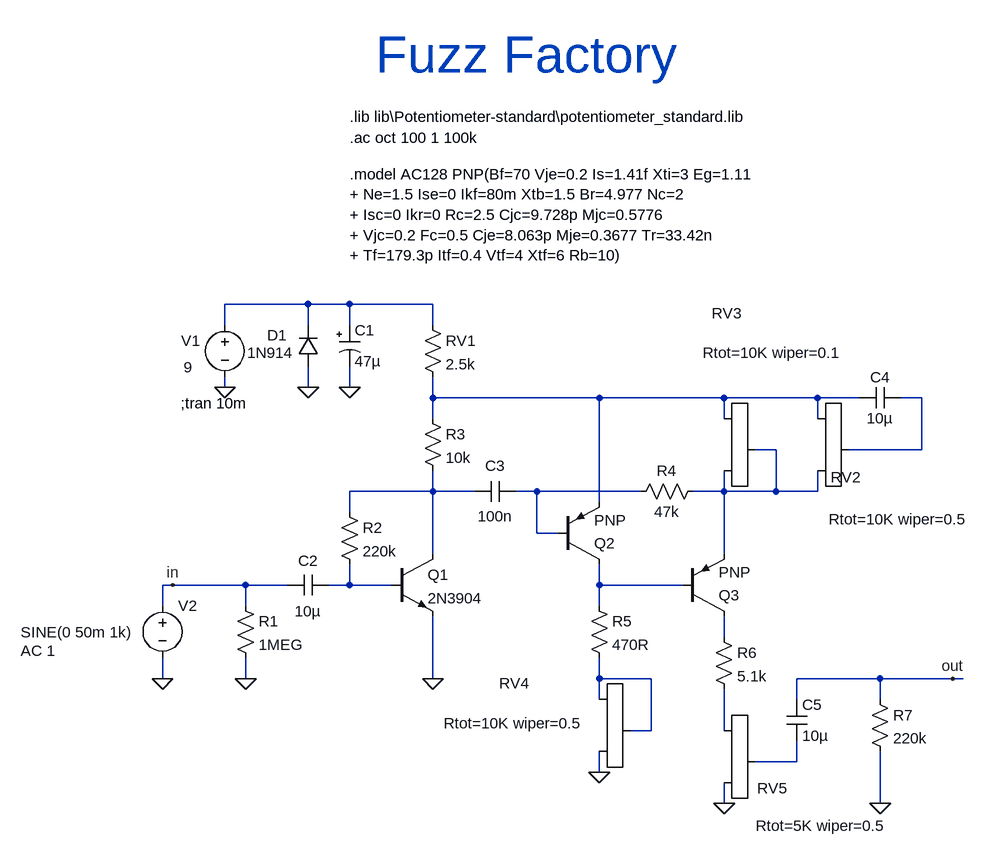
[diagram p0: schematic Fuzz Factory.asc]
Fuzz Factory.asc, the LTspice schematic file:
Version 4
SHEET 1 1632 832
WIRE 240 -16 112 -16
WIRE 304 -16 240 -16
WIRE 432 -16 304 -16
WIRE 112 16 112 -16
WIRE 240 16 240 -16
WIRE 304 16 304 -16
WIRE 432 16 432 -16
WIRE 112 112 112 96
WIRE 240 112 240 80
WIRE 304 112 304 80
WIRE 432 128 432 96
WIRE 688 128 432 128
WIRE 880 128 688 128
WIRE 1024 128 880 128
WIRE 1088 128 1024 128
WIRE 1184 128 1152 128
WIRE 432 160 432 128
WIRE 880 160 880 128
WIRE 1024 160 1024 128
WIRE 960 208 928 208
WIRE 1184 208 1184 128
WIRE 1184 208 1072 208
WIRE 432 272 432 240
WIRE 432 272 304 272
WIRE 496 272 432 272
WIRE 592 272 560 272
WIRE 752 272 592 272
WIRE 880 272 880 240
WIRE 880 272 832 272
WIRE 960 272 960 208
WIRE 960 272 880 272
WIRE 1024 272 1024 240
WIRE 1024 272 960 272
WIRE 688 288 688 128
WIRE 304 304 304 272
WIRE 592 336 592 272
WIRE 624 336 592 336
WIRE 432 368 432 272
WIRE 880 368 880 272
WIRE 32 416 16 416
WIRE 144 416 32 416
WIRE 208 416 144 416
WIRE 304 416 304 384
WIRE 304 416 272 416
WIRE 368 416 304 416
WIRE 688 416 688 384
WIRE 816 416 688 416
WIRE 16 448 16 416
WIRE 144 448 144 416
WIRE 688 448 688 416
WIRE 880 496 880 464
WIRE 16 560 16 528
WIRE 144 560 144 528
WIRE 432 560 432 464
WIRE 688 560 688 528
WIRE 768 560 688 560
WIRE 1120 560 992 560
WIRE 1232 560 1120 560
WIRE 1248 560 1232 560
WIRE 688 592 688 560
WIRE 992 592 992 560
WIRE 1120 592 1120 560
WIRE 768 640 768 560
WIRE 768 640 736 640
WIRE 880 640 880 576
WIRE 992 688 992 656
WIRE 992 688 928 688
WIRE 688 704 688 672
WIRE 880 752 880 720
WIRE 1120 752 1120 672
FLAG 240 112 0
FLAG 304 112 0
FLAG 112 112 0
FLAG 144 560 0
FLAG 432 560 0
FLAG 16 560 0
FLAG 688 704 0
FLAG 880 752 0
FLAG 1120 752 0
FLAG 1232 560 out
FLAG 32 416 in
SYMBOL diode 256 80 R180
WINDOW 0 48 48 Left 2
WINDOW 3 38 21 Left 2
SYMATTR InstName D1
SYMATTR Value 1N914
SYMBOL polcap 288 16 R0
WINDOW 3 24 56 Left 2
SYMATTR InstName C1
SYMATTR Value 47µ
SYMATTR Description Capacitor
SYMATTR Type cap
SYMATTR SpiceLine V=25 Irms=90m Rser=1.6 Lser=0 mfg="Nichicon" pn="UPR1E470MAH" type="Al electrolytic"
SYMBOL voltage 112 0 R0
WINDOW 0 -67 40 Left 2
WINDOW 3 -63 81 Left 2
WINDOW 123 0 0 Left 2
WINDOW 39 0 0 Left 2
SYMATTR InstName V1
SYMATTR Value 9
SYMBOL npn 368 368 R0
SYMATTR InstName Q1
SYMATTR Value 2N3904
SYMBOL res 416 144 R0
SYMATTR InstName R3
SYMATTR Value 10k
SYMBOL res 288 288 R0
SYMATTR InstName R2
SYMATTR Value 220k
SYMBOL cap 272 400 R90
WINDOW 0 -6 32 VBottom 2
WINDOW 3 41 32 VTop 2
SYMATTR InstName C2
SYMATTR Value 10µ
SYMBOL res 128 432 R0
SYMATTR InstName R1
SYMATTR Value 1MEG
SYMBOL voltage 16 432 R0
WINDOW 3 -218 57 Left 2
WINDOW 123 -218 85 Left 2
WINDOW 39 0 0 Left 2
SYMATTR InstName V2
SYMATTR Value SINE(0 50m 1k)
SYMATTR Value2 AC 1
SYMBOL cap 560 256 R90
WINDOW 0 -8 32 VBottom 2
WINDOW 3 39 32 VTop 2
SYMATTR InstName C3
SYMATTR Value 100n
SYMBOL pnp 624 384 M180
SYMATTR InstName Q2
SYMBOL pnp 816 464 M180
SYMATTR InstName Q3
SYMBOL res 672 432 R0
SYMATTR InstName R5
SYMATTR Value 470R
SYMBOL potentiometer_standard 672 576 R0
WINDOW 0 -138 -9 Left 2
WINDOW 3 -223 53 Left 2
WINDOW 39 -206 81 Left 2
WINDOW 38 -148 20 Left 2
SYMATTR InstName RV4
SYMATTR Value Rtot=10K wiper=0.5
SYMBOL res 864 480 R0
SYMATTR InstName R6
SYMATTR Value 5.1k
SYMBOL potentiometer_standard 864 624 R0
WINDOW 0 67 105 Left 2
WINDOW 3 65 162 Left 2
WINDOW 39 72 191 Left 2
WINDOW 38 68 132 Left 2
SYMATTR InstName RV5
SYMATTR Value Rtot=5K wiper=0.5
SYMBOL cap 976 592 R0
SYMATTR InstName C5
SYMATTR Value 10µ
SYMBOL res 848 256 R90
WINDOW 0 0 56 VBottom 2
WINDOW 3 32 56 VTop 2
SYMATTR InstName R4
SYMATTR Value 47k
SYMBOL potentiometer_standard 864 144 R0
WINDOW 0 -3 -146 Left 2
WINDOW 3 -17 -85 Left 2
WINDOW 39 -12 -50 Left 2
WINDOW 38 -1 -118 Left 2
SYMATTR InstName RV3
SYMATTR Value Rtot=10K wiper=0.1
SYMBOL res 1104 576 R0
SYMATTR InstName R7
SYMATTR Value 220k
SYMBOL potentiometer_standard 1008 144 R0
WINDOW 0 36 106 Left 2
WINDOW 3 33 171 Left 2
WINDOW 39 34 201 Left 2
WINDOW 38 35 136 Left 2
SYMATTR InstName RV2
SYMATTR Value Rtot=10K wiper=0.5
SYMBOL cap 1152 112 R90
WINDOW 0 0 32 VBottom 2
WINDOW 3 32 32 VTop 2
SYMATTR InstName C4
SYMATTR Value 10µ
SYMBOL res 416 0 R0
SYMATTR InstName RV1
SYMATTR Value 2.5k
TEXT 304 -304 Left 2 !.lib lib\\Potentiometer-standard\\potentiometer_standard.lib
TEXT 44 136 Left 2 !;tran 10m
TEXT 304 -272 Left 2 !.ac oct 100 1 100k
TEXT 304 -216 Left 2 !.model AC128 PNP(Bf=70 Vje=0.2 Is=1.41f Xti=3 Eg=1.11 \n+ Ne=1.5 Ise=0 Ikf=80m Xtb=1.5 Br=4.977 Nc=2\n+ Isc=0 Ikr=0 Rc=2.5 Cjc=9.728p Mjc=0.5776\n+ Vjc=0.2 Fc=0.5 Cje=8.063p Mje=0.3677 Tr=33.42n\n+ Tf=179.3p Itf=0.4 Vtf=4 Xtf=6 Rb=10)
TEXT 344 -400 Left 6 ;Fuzz Factory

The netlist it stands for:
* Fuzz Factory.asc
D1 0 N001 1N914
C1 N001 0 47µ V=25 Irms=90m Rser=1.6 Lser=0 mfg="Nichicon" pn="UPR1E470MAH" type="Al electrolytic"
V1 N001 0 9
Q1 N005 N007 0 0 2N3904
R3 N002 N005 10k
R2 N005 N007 220k
C2 N007 in 10µ
R1 in 0 1MEG
V2 in 0 SINE(0 50m 1k) AC 1
C3 N006 N005 100n
Q2 N008 N006 N002 0 PNP
Q3 N009 N008 N004 0 PNP
R5 N008 N010 470R
XRV4 N010 0 N010 Rtot=10K wiper=0.5
R6 N009 N011 5.1k
XRV5 N011 0 N012 Rtot=5K wiper=0.5
C5 out N012 10µ
R4 N004 N006 47k
XRV3 N002 N004 N004 Rtot=10K wiper=0.1
R7 out 0 220k
XRV2 N002 N004 N003 Rtot=10K wiper=0.5
C4 N003 N002 10µ
RV1 N001 N002 2.5k
.model D D
.lib standard.dio
.model NPN NPN
.model PNP PNP
.lib standard.bjt
.lib lib\Potentiometer-standard\potentiometer_standard.lib
;tran 10m
.ac oct 100 1 100k
.model AC128 PNP(Bf=70 Vje=0.2 Is=1.41f Xti=3 Eg=1.11
+ Ne=1.5 Ise=0 Ikf=80m Xtb=1.5 Br=4.977 Nc=2
+ Isc=0 Ikr=0 Rc=2.5 Cjc=9.728p Mjc=0.5776
+ Vjc=0.2 Fc=0.5 Cje=8.063p Mje=0.3677 Tr=33.42n
+ Tf=179.3p Itf=0.4 Vtf=4 Xtf=6 Rb=10)
* Fuzz Factory
.backanno
.end